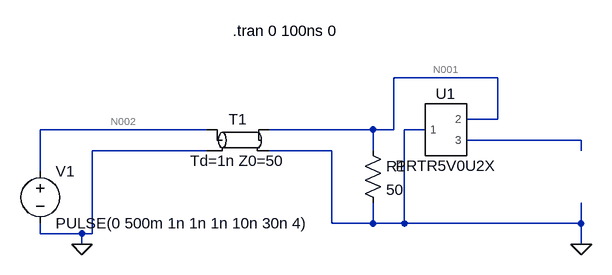
[diagram p0: schematic ESD SIM.asc]
ESD SIM.asc, the LTspice schematic file:
Version 4
SHEET 1 984 680
WIRE 800 48 640 48
WIRE 800 112 800 48
WIRE 800 112 752 112
WIRE 352 128 96 128
WIRE 608 128 448 128
WIRE 640 128 640 48
WIRE 640 128 608 128
WIRE 688 128 656 128
WIRE 928 144 752 144
WIRE 352 160 176 160
WIRE 544 160 448 160
WIRE 608 160 608 128
WIRE 928 160 928 144
WIRE 96 192 96 128
WIRE 544 272 544 160
WIRE 608 272 608 240
WIRE 608 272 544 272
WIRE 656 272 656 128
WIRE 656 272 608 272
WIRE 928 272 928 240
WIRE 928 272 656 272
WIRE 96 288 96 272
WIRE 160 288 96 288
WIRE 176 288 176 160
WIRE 176 288 160 288
WIRE 160 304 160 288
WIRE 928 304 928 272
FLAG 160 304 0
FLAG 928 304 0
SYMBOL PRTR5V0U2X 720 128 R0
SYMATTR InstName U1
SYMBOL voltage 96 176 R0
WINDOW 123 0 0 Left 0
WINDOW 39 0 0 Left 0
SYMATTR InstName V1
SYMATTR Value PULSE(0 500m 1n 1n 1n 10n 30n 4)
SYMBOL tline 400 144 R0
SYMATTR InstName T1
SYMATTR Value Td=1n Z0=50
SYMBOL res 592 144 R0
SYMATTR InstName R1
SYMATTR Value 50
TEXT 392 -24 Left 2 !.tran 0 100ns 0

The netlist it stands for:
* ESD SIM.asc
XU1 0 N001 N003 PRTR5V0U2X  ; pins 1 2 3
V1 N002 0 PULSE(0 500m 1n 1n 1n 10n 30n 4)
T1 N002 0 N001 0 Td=1n Z0=50
R1 N001 0 50
.tran 0 100ns 0
.lib C:\Jeonghyun\GIT\RFSoC_FrontEnd\Simulation\SpartanSim\ESD\PRTR5V0U2X.lib
.backanno
.end

* Results of the author's LTspice run, read from the files saved beside the schematic
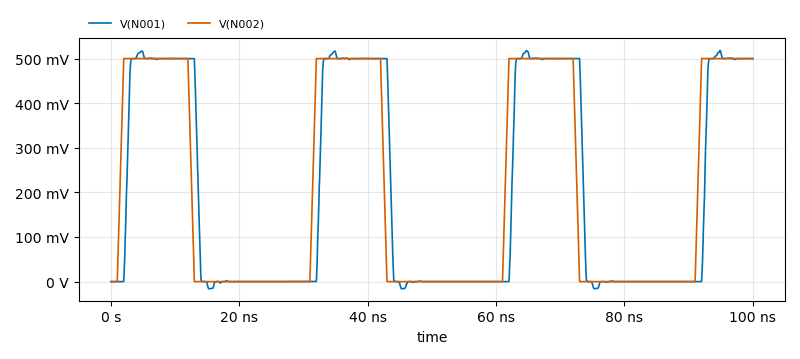
[diagram p1: Transient Analysis of ESD SIM.asc, plotted from the saved traces]
* Transient Analysis, 1 run:
*   V(N001): min -16.14 mV, max 518.4 mV, average 202 mV, rms 314 mV, last 500 mV
*   V(N002): min 0 V, max 500 mV, average 207.5 mV, rms 318.4 mV, last 500 mV